# Altium schematic sheet 01_MCU_POWER.SchDoc
size A2; SheetNumber: 2; SheetTotal: 4
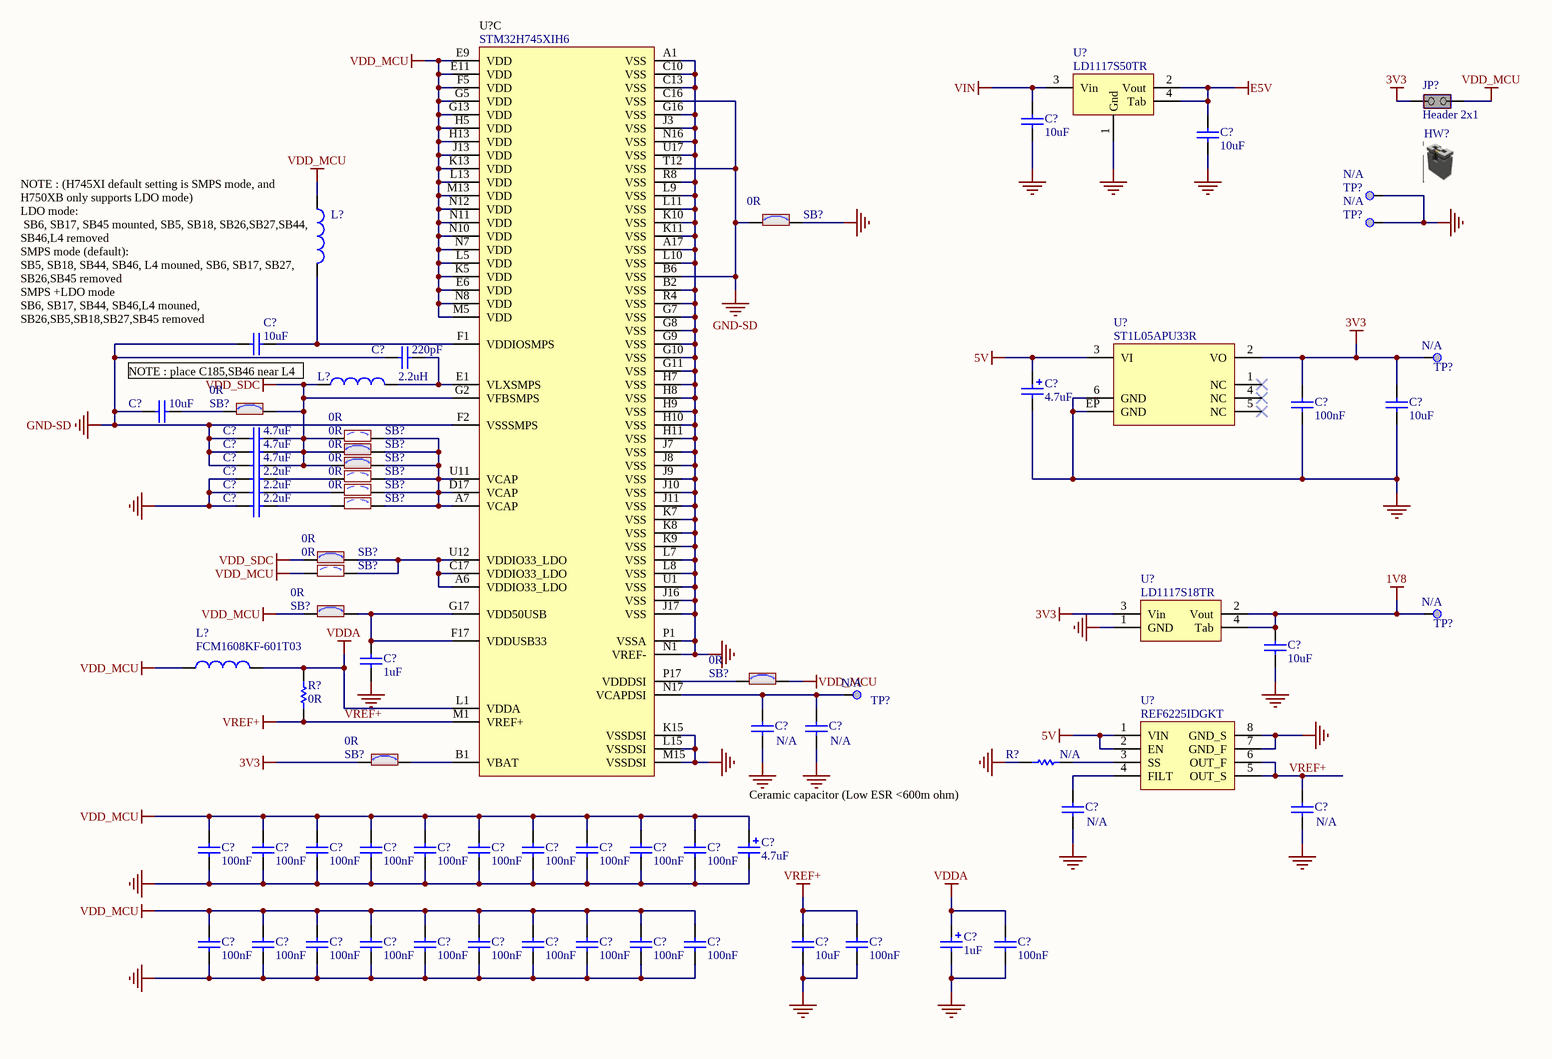
[diagram p0: 01_MCU_POWER.SchDoc]

## Parts
(Parts that share a designator on the sheet are numbered #1, #2 ... from top to bottom, then left to right.)
C?#1  value 10uF  [C0805]  (hidden comment: Capacitor)
C?#2  value 10uF  [C0805]  (hidden comment: Capacitor)
C?#3  value 10uF  [C0402]  (hidden comment: Capacitor)
C?#4  value 220pF  [C0402]  (hidden comment: Capacitor)
C?#5  value 4.7uF  [CPOL_VISHAY_TANTAL-595D_1407_H220]  (hidden comment: Cap_POL_TANA)
C?#6  value 10uF  [C0603]  (hidden comment: Capacitor)
C?#7  value 100nF  [C0402]  (hidden comment: Capacitor)
C?#8  value 10uF  [C0805]  (hidden comment: Capacitor)
C?#9  value 4.7uF  [C0402]  (hidden comment: Capacitor)
C?#10  value 2.2uF  [C0603]  (hidden comment: Capacitor)
C?#11  value 4.7uF  [C0402]  (hidden comment: Capacitor)
C?#12  value 2.2uF  [C0603]  (hidden comment: Capacitor)
C?#13  value 4.7uF  [C0402]  (hidden comment: Capacitor)
C?#14  value 2.2uF  [C0603]  (hidden comment: Capacitor)
C?#15  value 10uF  [C0805]  (hidden comment: Capacitor)
C?#16  value 1uF  [C0603]  (hidden comment: Capacitor)
C?#17  N/A  [C0603]
C?#18  N/A  [C0402]
C?#19  N/A  [C0603]
C?#20  N/A  [C1210]
C?#21  value 4.7uF  [CPOL_VISHAY_TANTAL-595D_1407_H220]  (hidden comment: Cap_POL_TANA)
C?#22  value 100nF  [C0402]  (hidden comment: Capacitor)
C?#23  value 100nF  [C0402]  (hidden comment: Capacitor)
C?#24  value 100nF  [C0402]  (hidden comment: Capacitor)
C?#25  value 100nF  [C0402]  (hidden comment: Capacitor)
C?#26  value 100nF  [C0402]  (hidden comment: Capacitor)
C?#27  value 100nF  [C0402]  (hidden comment: Capacitor)
C?#28  value 100nF  [C0402]  (hidden comment: Capacitor)
C?#29  value 100nF  [C0402]  (hidden comment: Capacitor)
C?#30  value 100nF  [C0402]  (hidden comment: Capacitor)
C?#31  value 100nF  [C0402]  (hidden comment: Capacitor)
C?#32  value 1uF  [CPOL_VISHAY_TANTAL-595D_1407_H220]  (hidden comment: Cap_POL_TANA)
C?#33  value 100nF  [C0402]  (hidden comment: Capacitor)
C?#34  value 100nF  [C0402]  (hidden comment: Capacitor)
C?#35  value 100nF  [C0402]  (hidden comment: Capacitor)
C?#36  value 100nF  [C0402]  (hidden comment: Capacitor)
C?#37  value 100nF  [C0402]  (hidden comment: Capacitor)
C?#38  value 100nF  [C0402]  (hidden comment: Capacitor)
C?#39  value 100nF  [C0402]  (hidden comment: Capacitor)
C?#40  value 100nF  [C0402]  (hidden comment: Capacitor)
C?#41  value 100nF  [C0402]  (hidden comment: Capacitor)
C?#42  value 100nF  [C0402]  (hidden comment: Capacitor)
C?#43  value 10uF  [C0805]  (hidden comment: Capacitor)
C?#44  value 100nF  [C0402]  (hidden comment: Capacitor)
C?#45  value 100nF  [C0402]  (hidden comment: Capacitor)
HW?  Shunt 2.54mm  [N/A]  (value not drawn)  (mechanical)
JP?  value Header 2x1  [CON_SAMTEC_TSW-102-07-G-S]  (hidden comment: Shunt Fitted)
L?#1  Inductor  [IND_TAIYO-YUDEN_FBMJ1608]  (value not drawn)
L?#2  value 2.2uH  [IND_2016_MURATA_LQM2MPN2R2NG0]
L?#3  Manufacturer_Part_Number: FCM1608KF-601T03  [L0603]  (hidden comment: BEAD)
R?#1  value 0R  [R0603]  (hidden comment: Resistor)
R?#2  N/A  [R0402]
SB?#1  value 0R  [SOLDER-BRIDGE_R0603-0R]  (hidden comment: SB_ON)
SB?#2  value 0R  [SOLDER-BRIDGE_R0603-0R]  (hidden comment: SB_ON)
SB?#3  value 0R  [SOLDER-BRIDGE_R0603-0R]  (hidden comment: SB_OFF)
SB?#4  value 0R  [SOLDER-BRIDGE_R0603-0R]  (hidden comment: SB_ON)
SB?#5  value 0R  [SOLDER-BRIDGE_R0603-0R]  (hidden comment: SB_ON)
SB?#6  value 0R  [SOLDER-BRIDGE_R0603-0R]  (hidden comment: SB_OFF)
SB?#7  value 0R  [SOLDER-BRIDGE_R0603-0R]  (hidden comment: SB_OFF)
SB?#8  value 0R  [SOLDER-BRIDGE_R0603-0R]  (hidden comment: SB_OFF)
SB?#9  value 0R  [SOLDER-BRIDGE_R0603-0R]  (hidden comment: SB_ON)
SB?#10  value 0R  [SOLDER-BRIDGE_R0603-0R]  (hidden comment: SB_OFF)
SB?#11  value 0R  [SOLDER-BRIDGE_R0603-0R]  (hidden comment: SB_ON)
SB?#12  value 0R  [SOLDER-BRIDGE_R0603-0R]  (hidden comment: SB_ON)
SB?#13  value 0R  [SOLDER-BRIDGE_R0603-0R]  (hidden comment: SB_ON)
TP?#1  Test Point  [TP_SMD_0-3MM]  (value not drawn)  (no BOM)
TP?#2  Test Point  [TP_SMD_0-3MM]  (value not drawn)  (no BOM)
TP?#3  Test Point  [TP_SMD_0-3MM]  (value not drawn)  (no BOM)
TP?#4  Test Point  [TP_SMD_0-3MM]  (value not drawn)  (no BOM)
TP?#5  Test Point  [TP_SMD_0-3MM]  (value not drawn)  (no BOM)
U?#1  value STM32H745XIH6  [ICC_TFBGA240+25_14X14_STM32H745H6U_P080]  (part C of 3)
U?#2  LD1117S50TR  [REG_SOT223-TAB]
U?#3  ST1L05APU33R  [ICC_DFN6-EPAD_3X3_P095]
U?#4  value LD1117S18TR  [REG_SOT223-TAB]
U?#5  value REF6225IDGKT  [ICC_VSSOP8_DGK_S-PDSO-G8_3X3_P065]

## Nets
1V8: C?#15.2 TP?#4.1 U?#4.2(Vout) U?#4.4(Tab)
3V3: C?#7.1 C?#8.2 JP?.2(NO) SB?#13.1 TP?#3.1 U?#3.2(VO) U?#4.3(Vin)
5V: C?#5.1 U?#3.3(VI) U?#5.1(VIN) U?#5.2(EN)
E5V: C?#2.2 U?#2.2(Vout) U?#2.4(Tab)
GND: C?#1.1 C?#2.1 C?#5.2 C?#7.2 C?#8.1 C?#10.1 C?#12.1 C?#14.1 C?#15.1 C?#16.1 C?#17.1 C?#18.1 C?#19.1 C?#20.1 C?#21.2 C?#22.1 C?#23.1 C?#24.1 C?#25.1 C?#26.1 C?#27.1 C?#28.1 C?#29.1 C?#30.1 C?#31.1 C?#32.2 C?#33.1 C?#34.1 C?#35.1 C?#36.1 C?#37.1 C?#38.1 C?#39.1 C?#40.1 C?#41.1 C?#42.1 C?#43.1 C?#44.1 C?#45.1 R?#2.1 SB?#1.2 TP?#1.1 TP?#2.1 U?#1.A1(VSS) U?#1.A17(VSS) U?#1.B2(VSS) U?#1.C10(VSS) U?#1.C13(VSS) U?#1.G7(VSS) U?#1.G8(VSS) U?#1.G9(VSS) U?#1.G10(VSS) U?#1.G11(VSS) U?#1.G16(VSS) U?#1.H7(VSS) U?#1.H8(VSS) U?#1.H9(VSS) U?#1.H10(VSS) U?#1.H11(VSS) U?#1.J3(VSS) U?#1.J7(VSS) U?#1.J8(VSS) U?#1.J9(VSS) U?#1.J10(VSS) U?#1.J11(VSS) U?#1.J16(VSS) U?#1.J17(VSS) U?#1.K7(VSS) U?#1.K8(VSS) U?#1.K9(VSS) U?#1.K10(VSS) U?#1.K11(VSS) U?#1.K15(VSSDSI) U?#1.L7(VSS) U?#1.L8(VSS) U?#1.L9(VSS) U?#1.L10(VSS) U?#1.L11(VSS) U?#1.L15(VSSDSI) U?#1.M15(VSSDSI) U?#1.N1(VREF-) U?#1.N16(VSS) U?#1.P1(VSSA) U?#1.R4(VSS) U?#1.R8(VSS) U?#1.U1(VSS) U?#1.U17(VSS) U?#2.1(Gnd) U?#3.6(GND) U?#3.EP(GND) U?#4.1(GND) U?#5.7(GND_F) U?#5.8(GND_S)
GND-SD: C?#3.1 C?#4.1 C?#6.1 C?#9.2 C?#11.2 C?#13.2 SB?#1.1 U?#1.B6(VSS) U?#1.C16(VSS) U?#1.F2(VSSSMPS) U?#1.T12(VSS)
VDD_MCU: C?#21.1 C?#22.2 C?#23.2 C?#24.2 C?#25.2 C?#26.2 C?#27.2 C?#28.2 C?#29.2 C?#30.2 C?#31.2 C?#33.2 C?#34.2 C?#35.2 C?#36.2 C?#37.2 C?#38.2 C?#39.2 C?#40.2 C?#41.2 C?#42.2 JP?.1(COMMON) L?#1.1 L?#3.1 SB?#10.1 SB?#11.1 SB?#12.2 U?#1.E6(VDD) U?#1.E9(VDD) U?#1.E11(VDD) U?#1.F5(VDD) U?#1.G5(VDD) U?#1.G13(VDD) U?#1.H5(VDD) U?#1.H13(VDD) U?#1.J13(VDD) U?#1.K5(VDD) U?#1.K13(VDD) U?#1.L5(VDD) U?#1.L13(VDD) U?#1.M5(VDD) U?#1.M13(VDD) U?#1.N7(VDD) U?#1.N8(VDD) U?#1.N10(VDD) U?#1.N11(VDD) U?#1.N12(VDD)
VDD_SDC: C?#9.1 C?#11.1 C?#13.1 L?#2.1 SB?#2.2 SB?#3.1 SB?#4.1 SB?#5.1 SB?#9.1 U?#1.G2(VFBSMPS)
VDDA: C?#32.1 C?#45.2 L?#3.2 R?#1.1 U?#1.L1(VDDA)
VIN: C?#1.2 U?#2.3(Vin)
VREF+: C?#20.2 C?#43.2 C?#44.2 R?#1.2 U?#1.M1(VREF+) U?#5.5(OUT_S) U?#5.6(OUT_F)
NetC?#3_2: C?#3.2 L?#1.2 U?#1.F1(VDDIOSMPS)
NetC?#4_2: C?#4.2 L?#2.2 U?#1.E1(VLXSMPS)
NetC?#6_2: C?#6.2 SB?#2.1
NetC?#10_2: C?#10.2 SB?#6.1
NetC?#12_2: C?#12.2 SB?#7.1
NetC?#14_2: C?#14.2 SB?#8.1
NetC?#16_2: C?#16.2 SB?#11.2 U?#1.F17(VDDUSB33) U?#1.G17(VDD50USB)
NetC?#17_2: C?#17.2 C?#18.2 TP?#5.1 U?#1.N17(VCAPDSI)
NetC?#19_2: C?#19.2 U?#5.4(FILT)
NetR?#2_2: R?#2.2 U?#5.3(SS)
NetSB?#3_2: SB?#3.2 SB?#4.2 SB?#5.2 SB?#6.2 SB?#7.2 SB?#8.2 U?#1.A7(VCAP) U?#1.D17(VCAP) U?#1.U11(VCAP)
NetSB?#9_2: SB?#9.2 SB?#10.2 U?#1.A6(VDDIO33_LDO) U?#1.C17(VDDIO33_LDO) U?#1.U12(VDDIO33_LDO)
NetSB?#12_1: SB?#12.1 U?#1.P17(VDDDSI)
NetSB?#13_2: SB?#13.2 U?#1.B1(VBAT)

Not connected (* = marked no-connect by the designer): U?#3 1(NC)* 4(NC)* 5(NC)*

## Notes on the sheet
- (near L?#1) NOTE : (H745XI default setting is SMPS mode, and H750XB only supports LDO mode)
  LDO mode:
  SB6, SB17, SB45 mounted, SB5, SB18, SB26,SB27,SB44, SB46,L4 removed
  SMPS mode (default):
  SB5, SB18, SB44, SB46, L4 mouned, SB6, SB17, SB27, SB26,SB45 removed
  SMPS +LDO mode
  SB6, SB17, SB44, SB46,L4 mouned, SB26,SB5,SB18,SB27,SB45 removed
- NOTE : place C185,SB46 near L4
- (near C?#21) Ceramic capacitor (Low ESR <600m ohm)

## Library data of the parts
C?#1 C?#2 C?#8 C?#15 C?#43 = MCD-00014: Capacitor, MLCC, 10uF, 25V, X5R, 10%, 0805, T=0,85mm; Manufacturer_Part_Number: CC0805KRX5R8BB106; Manufacturer: YAGEO; Full_Alternate_Internal_Part_Number: MCD-02385; Part_Preference: Recommended; Partial_Alternate_Internal_Part_Number: MCD-03053; Provided_By: Subcon; Initial_Board_Reference: mb1274; Component_Country_Of_Origin: China; ID: 2468; ShowFields: YES; Internal_Part_Number: MCD-00014; ECCN_US: n/a; ECCN_EU: n/a; ComponentLink1Description: Yageo_Capacitor_X5R-series.pdf; Status: Released; Part_Type: Capacitor; Package: 0805; ComponentLink1URL: http://tunmcdsvn.tun.st.com/Component_Documentation_Library/Trunk/Capacitor/YAGEO_X5R_Series; Order_Code_Digikey: 311-3503-1-ND; Order_Code_Farnell: N/A; Order_Code_RS: N/A
C?#3 = MCD-01355: Capacitor, MLCC, 10uF, 4V, X5R, 20%, 0402, T=0,5mm; Manufacturer_Part_Number: GRM155R60G106ME44; Manufacturer: MURATA; Part_Preference: Recommended; Partial_Alternate_Internal_Part_Number: MCD-01716, MCD-02999; Provided_By: Subcon; Initial_Board_Reference: MB1372; Component_Country_Of_Origin: Japan°°; ID: 3455; Order_Code_RS: 172-6477; ShowFields: YES; Internal_Part_Number: MCD-01355; ComponentLink1Description: Datasheet; Status: Released; Part_Type: Capacitor; Package: 0402; ComponentLink1URL: http://tunmcdsvn.tun.st.com/Component_Documentation_Library/Trunk/Capacitor/MURATA_GRM_Series; Order_Code_Digikey: 490-10693-1-ND; Order_Code_Farnell: 2611904
C?#4 = MCD-01225: Capacitor, MLCC, 220pF, 50V, NPO, 5%, 0402, T=0,5mm; Manufacturer_Part_Number: CC0402JRNPO9BN221; Manufacturer: YAGEO; Part_Preference: Recommended; Provided_By: Subcon; Initial_Board_Reference: MB1331; Component_Country_Of_Origin: China; ID: 3272; Order_Code_RS: 616-9284; ShowFields: YES; Internal_Part_Number: MCD-01225; Status: Released; Part_Type: Capacitor; Package: 0402; ComponentLink1Description: Datasheet; ComponentLink1URL: http://tunmcdsvn.tun.st.com/Component_Documentation_Library/Trunk/Capacitor/YAGEO_NP0_Series; Order_Code_Digikey: 311-1416-1-ND; Order_Code_Farnell: 3019240
C?#5 C?#21 = MCD-00595: Capacitor, Tantalum, 4.7uF, 16V, +/-10%, 595D case A; Manufacturer_Part_Number: 595D475X9016A2T; Manufacturer: VISHAY; Part_Preference: Recommended; Order_Code_RS: 117-303; Provided_By: Subcon; Initial_Board_Reference: MB1331; Component_Country_Of_Origin: Israel; ID: 3146; ShowFields: YES; Revision: July-2002: Re-released for DXP Platform.; Internal_Part_Number: MCD-00595; Status: Released; Part_Type: Capacitor; ComponentLink1Description: VISHAY_CAPACITOR_TANTALUM_595D.pdf; ComponentLink1URL: http://tunmcdsvn.tun.st.com/Component_Documentation_Library/Trunk/Capacitor/VISHAY_595D_Series; Order_Code_Digikey: 595D475X9016A2T-ND; Order_Code_Farnell: 1166805; Package: 3718 (metric)
C?#6 = MCD-01341: Capacitor, MLCC, 10uF, 6V3, X5R, 20%, 0603, T=0,8mm; Manufacturer_Part_Number: GRM188R60J106ME47D; Manufacturer: MURATA; Part_Preference: Recommended; Provided_By: Subcon; Initial_Board_Reference: MB1331; Component_Country_Of_Origin: Japan°°; ID: 3441; ShowFields: YES; Internal_Part_Number: MCD-01341; ComponentLink1Description: Datasheet; Status: Released; Part_Type: Capacitor; Package: 0603; ComponentLink1URL: http://tunmcdsvn.tun.st.com/Component_Documentation_Library/Trunk/Capacitor/MURATA_GRM_Series; Order_Code_Digikey: 490-3896-1-ND; Order_Code_Farnell: 1735528; Order_Code_RS: N/A
C?#7 C?#18 C?#22-C?#31 C?#33-C?#42 C?#44 C?#45 = MCD-00006: Capacitor, MLCC, 100nF, 16V, X7R, +/-10%, 0402, T=0.5mm; Manufacturer_Part_Number: CC0402KRX7R7BB104; Manufacturer: YAGEO; Part_Preference: Recommended; Partial_Alternate_Internal_Part_Number: MCD-03299; Component_Country_Of_Origin: China; ID: 2474; Order_Code_RS: 9402047; ShowFields: YES; Internal_Part_Number: MCD-00006; Status: Released; Part_Type: Capacitor; Package: 0402; ComponentLink1URL: http://tunmcdsvn.tun.st.com/Component_Documentation_Library/Trunk/Capacitor/YAGEO_X7R_Series; Order_Code_Digikey: 311-1338-1-ND; Order_Code_Farnell: 9402047
  C?#18: Value: 100nF
C?#9 C?#11 C?#13 = MCD-01356: Capacitor, MLCC, 4.7uF, 6V3, X5R, 20%, 0402, T=0,5mm; Manufacturer_Part_Number: GRM155R60J475ME47; Manufacturer: MURATA; Part_Preference: Recommended; Provided_By: Subcon; Initial_Board_Reference: MB1372; Component_Country_Of_Origin: Japan°°; ID: 3456; Order_Code_RS: 814-5230; ShowFields: YES; Internal_Part_Number: MCD-01356; ComponentLink1Description: Datasheet; Status: Released; Part_Type: Capacitor; Package: 0402; ComponentLink1URL: http://tunmcdsvn.tun.st.com/Component_Documentation_Library/Trunk/Capacitor/MURATA_GRM_Series; Order_Code_Digikey: 490-5915-1-ND; Order_Code_Farnell: 2666407
C?#10 C?#12 C?#14 C?#17 = MCD-00012: Capacitor, MLCC, 2.2uF, 10V, X5R, 10%, 0603, T=0,8mm; Manufacturer_Part_Number: CC0603KRX5R6BB225; Manufacturer: YAGEO; Alternate_Manufacturer_Part_Number: C0603C225K8PACTU; Alternate_Manufacturer: KEMET; BMS_Part_Number: 9142010; Part_Preference: Recommended; Partial_Alternate_Internal_Part_Number: MCD-00551; Provided_By: Subcon; Initial_Board_Reference: MB1274; Component_Country_Of_Origin: China; ID: 2467; Order_Code_RS: 2370679; ShowFields: YES; Internal_Part_Number: MCD-00012; Status: Released; Part_Type: Capacitor; Package: 0603; ComponentLink1Description: Yageo_Capacitor_X5R-series.pdf; ComponentLink1URL: http://tunmcdsvn.tun.st.com/Component_Documentation_Library/Trunk/Capacitor/YAGEO_X5R_Series; ECCN_US: n/a; ECCN_EU: n/a; Order_Code_Digikey: 311-1451-1-ND; Order_Code_Farnell: 2370679
  C?#17: Value: 2.2uF
C?#16 C?#19 = MCD-00010: Capacitor, MLCC, 1uF, 16V, X5R, 10%, 0603, T=0,8mm; Manufacturer_Part_Number: CC0603KRX5R7BB105; Manufacturer: YAGEO; Part_Preference: Recommended; Provided_By: Subcon; Initial_Board_Reference: mb1274; Component_Country_Of_Origin: China; ID: 2470; Order_Code_RS: 2370680; ShowFields: YES; Internal_Part_Number: MCD-00010; Status: Released; Part_Type: Capacitor; Package: 0603; ComponentLink1Description: Yageo_Capacitor_X5R-series.pdf; ComponentLink1URL: http://tunmcdsvn.tun.st.com/Component_Documentation_Library/Trunk/Capacitor/YAGEO_X5R_Series; ECCN_US: n/a; ECCN_EU: n/a; Order_Code_Digikey: 311-1444-1-ND; Order_Code_Farnell: 2370680
  C?#19: Value: 1uF
C?#20 = MCD-00614: Capacitor, MLCC, 22uF, 16V, 1210, X7R, 20%, T=2,5mm, ESR 2mohm@410KHz; Manufacturer_Part_Number: GCM32ER71C226ME19; Manufacturer: MURATA; Part_Preference: Recommended; Provided_By: Subcon; Initial_Board_Reference: MB1331; Component_Country_Of_Origin: Japan°°; ID: 3130; ShowFields: YES; Internal_Part_Number: MCD-00614; Value: 22uF; Status: Released; Part_Type: Capacitor; Package: 1210; ComponentLink1Description: Murata_22uF_1210_GCM32ER71C226ME19.pdf; ComponentLink1URL: http://tunmcdsvn.tun.st.com/Component_Documentation_Library/Trunk/Capacitor/MURATA_GC_Series; Order_Code_Digikey: 490-14539-1-ND; Order_Code_Farnell: N/A; Order_Code_RS: N/A
C?#32 = MCD-00594: Capacitor, Tantalum, 1uF, 35V, +/-10%, 595D case A; Manufacturer_Part_Number: 595D105X9035A2T; Manufacturer: VISHAY; Part_Preference: Recommended; Order_Code_RS: 117-404; Provided_By: Subcon; Initial_Board_Reference: MB1331; Component_Country_Of_Origin: Israel; ID: 3150; ShowFields: YES; Revision: July-2002: Re-released for DXP Platform.; Internal_Part_Number: MCD-00594; Status: Released; Part_Type: Capacitor; ComponentLink1Description: VISHAY_CAPACITOR_TANTALUM_595D.pdf; ComponentLink1URL: http://tunmcdsvn.tun.st.com/Component_Documentation_Library/Trunk/Capacitor/VISHAY_595D_Series; Order_Code_Digikey: 595D105X9035A2T-ND; Order_Code_Farnell: 1166819; Package: 3718 (metric)
HW? = MCD-00043: SHUNT 2.54mm BLACK; Manufacturer_Part_Number: SNT-100-BK-G; Manufacturer: SAMTEC; Full_Alternate_Internal_Part_Number: MCD-02388; Manufacturer_HQ_COO: Unknown; Part_Preference: Recommended; Part_Type: Misc; Partial_Alternate_Internal_Part_Number: MCD-01849, MCD-01864; Provided_By: Subcon; Alternate_EMS: A; Component_Country_Of_Origin: China, Costa Rica, Malaysia, USA, Vietnam; ID: 2551; Order_Code_RS: 158-7784; ShowFields: YES; Value: SNT-100-BK-G; Internal_Part_Number: MCD-00043; PartType: Mechanical; ECCN_US: n/a; ECCN_EU: n/a; ComponentLink1Description: Samtec_Shunt_Jumper_SNT100.pdf; ComponentLink1URL: http://tunmcdsvn.tun.st.com/Component_Documentation_Library/Trunk/Misc/SAMTEC_SNT-100-BK-G; Order_Code_Digikey: SAM8858-ND; Order_Code_Farnell: 2505007; Package: 2.54x5.08mm; Status: Released
JP? = MCD-00683: Header, 2x1, 2.54mm, VR, TH, T=5.84mm/2.54mm; Part_Type: Connector; Manufacturer_Part_Number: TSW-102-07-G-S; Manufacturer: SAMTEC; Part_Preference: Recommended; Full_Alternate_Internal_Part_Number: MCD-02389; Partial_Alternate_Internal_Part_Number: MCD-02957, MCD-03720; Component_Country_Of_Origin: China, Costa Rica, Malaysia, USA, Vietnam; ID: 3057; Order_Code_RS: 155-5312; ShowFields: YES; Internal_Part_Number: MCD-00683; Status: Released; ComponentLink1URL: http://tunmcdsvn.tun.st.com/Component_Documentation_Library/Trunk/Connector/SAMTEC_TSW_Series/; Order_Code_Digikey: SAM1029-02-ND; Order_Code_Farnell: 2505044
L?#1 = MCD-01431: Ferrite bead, 18R @ 100MHz, +/-30%, 750mA, 0R004, 0603, T=1mm; Manufacturer_Part_Number: FBMJ1608HM180NTR; Manufacturer: TAIYO YUDEN; Part_Preference: Forbidden; ShowFields: YES; ID: 3531; Component_Country_Of_Origin: Unknown; Internal_Part_Number: MCD-01431; Value: 18R @ 100MHz; Status: Obsolete; Part_Type: Inductor; Package: 0603; ComponentLink1URL: http://tunmcdsvn.tun.st.com/Component_Documentation_Library/Trunk/Inductor/TAIYO_YUDEN_FB-M_Series; Order_Code_Digikey: 587-3251-1-ND; Order_Code_Farnell: 2860452; Order_Code_RS: N/A
L?#2 = MCD-01110: Inductor 2.2uH, 2x1.6x0.9mm; Manufacturer_Part_Number: LQM2MPN2R2NG0; Manufacturer: MURATA; Part_Preference: Recommended; Provided_By: Subcon; Initial_Board_Reference: MB1381; Component_Country_Of_Origin: Japan°°; ID: 3384; ShowFields: YES; Internal_Part_Number: MCD-01110; Status: Checked; Part_Type: Inductor; ComponentLink1Description: Murata_inductor_LQM2MPN.pdf; ComponentLink1URL: http://tunmcdsvn.tun.st.com/Component_Documentation_Library/Trunk/Inductor/MURATA_LQM_Series; ECCN_US: n/a; ECCN_EU: n/a; Order_Code_Digikey: 490-7786-1-ND; Order_Code_Farnell: 2470314; Order_Code_RS: N/A; Package: 0806
L?#3 = MCD-00047: Ferrite bead, 600R @1 00MHz, +/-25%, 350mA, 0R5, 0603, T=0.8mm; Part_Type: Inductor; Manufacturer: TAI-TECH; Part_Preference: Recommended; Partial_Alternate_Internal_Part_Number: MCD-02959; Component_Country_Of_Origin: Unknown; ID: 2546; ShowFields: YES; Internal_Part_Number: MCD-00047; Value: 600R @ 100MHz; Status: Released; ComponentLink1URL: http://tunmcdsvn.tun.st.com/Component_Documentation_Library/Trunk/Inductor/TAI-TECH_FCM-1608_Series; Order_Code_Digikey: N/A; Order_Code_Farnell: N/A; Order_Code_RS: N/A; Package: 0603
R?#1 = MCD-00181: Resistor,0R,0603,ULO; Manufacturer_Part_Number: PMR03EZPJ000; Manufacturer: ROHM SEMICONDUCTOR; Part_Preference: Recommended; Provided_By: Subcon; Component_Country_Of_Origin: Philippines, Thailand°°; ID: 2691; ShowFields: YES; Internal_Part_Number: MCD-00181; Status: Released; Part_Type: Resistor; Package: 0603; ComponentLink1Description: ROHM_ULtra low Ohmic Resistor _PMR10EZPJ000.pdf; ComponentLink1URL: http://tunmcdsvn.tun.st.com/Component_Documentation_Library/Trunk/Resistor/ROHM_PMR_Series; ECCN_US: n/a; ECCN_EU: n/a; Order_Code_Digikey: PMR03EZPJ000-ND; Order_Code_Farnell: N/A; Order_Code_RS: N/A
R?#2 = MCD-00166: Resistor,120K,0402,1%,1/16W; Manufacturer_Part_Number: RC0402FR-07120KL; Manufacturer: YAGEO; Part_Preference: Recommended; Provided_By: Subcon; Initial_Board_Reference: MB1264; Component_Country_Of_Origin: China; ID: 2703; ShowFields: YES; Internal_Part_Number: MCD-00166; Value: 120K; Status: Checked; Part_Type: Resistor; Package: 0402; ComponentLink1Description: Yageo_Resistor_RC0402-series.pdf; ComponentLink1URL: http://tunmcdsvn.tun.st.com/Component_Documentation_Library/Trunk/Resistor/YAGEO_RC_L_Series; ECCN_US: n/a; ECCN_EU: n/a; Order_Code_Digikey: 311-120KLRCT-ND; Order_Code_Farnell: 9239480; Order_Code_RS: N/A
SB?#1 SB?#2 SB?#4 SB?#5 SB?#9 SB?#11-SB?#13 = MCD-00071: Solder Bridge ON; Part_Type: Resistor; Manufacturer: YAGEO; Manufacturer_HQ_COO: Unknown; Manufacturer_Part_Number: RC0603JR-070RL; Part_Preference: Recommended; Provided_By: Subcon; Initial_Board_Reference: mb1274; Component_Country_Of_Origin: China; ID: 2521; Order_Code_RS: 199-5647; ShowFields: YES; Internal_Part_Number: MCD-00071; ECCN_US: n/a; ECCN_EU: n/a; Status: Released; ComponentLink1URL: http://tunmcdsvn.tun.st.com/Component_Documentation_Library/Trunk/Resistor/YAGEO_RC_Series; Order_Code_Digikey: 311-0.0GRTR-ND; Order_Code_Farnell: 2421846; Package: 0603
SB?#3 SB?#6-SB?#8 SB?#10 = MCD-00072: Solder Bridge OFF; Part_Type: Resistor; Manufacturer: YAGEO; Manufacturer_HQ_COO: Unknown; Manufacturer_Part_Number: RC0603JR-070RL; Part_Preference: Recommended; Initial_Board_Reference: mb1274; Component_Country_Of_Origin: China; ID: 2520; Order_Code_RS: 199-5647; ShowFields: YES; Internal_Part_Number: MCD-00072; Status: Released; ECCN_US: n/a; ECCN_EU: n/a; Provided_By: n/a; ComponentLink1URL: http://tunmcdsvn.tun.st.com/Component_Documentation_Library/Trunk/Resistor/YAGEO_RC_Series; Order_Code_Digikey: 311-0.0GRTR-ND; Order_Code_Farnell: 2421846; Package: 0603
TP?#1-TP?#5 = MCD-00630: Test Point 0.3mm; Part_Type: Misc; Part_Preference: Recommended; Initial_Board_Reference: MB1264; ID: 3115; ShowFields: YES; Component_Country_Of_Origin: Unknown; Internal_Part_Number: MCD-00630; Status: Released; ECCN_US: n/a; ECCN_EU: n/a; Provided_By: n/a; Manufacturer: N/A; Manufacturer_Part_Number: N/A; Order_Code_Digikey: N/A; Order_Code_Farnell: N/A; Order_Code_RS: N/A; Value: N/A; ComponentLink1URL: http://tunmcdsvn.tun.st.com/Component_Documentation_Library/Trunk; Manufacturer_HQ_COO: Unknown
U?#1 = MCD-01085: 32bit MCU TFBGA240+25; Part_Type: IC; Manufacturer: STMICROELECTRONICS; BMS_Part_Number: 9175307; Manufacturer_HQ_COO: EU; Part_Preference: Recommended; Provided_By: STM; Initial_Board_Reference: MB1381; Component_Country_Of_Origin: Philippines; ID: 3408; ShowFields: YES; Internal_Part_Number: MCD-01085; Status: Checked; Manufacturer_Part_Number: STM32H745XIH6; Package: TFBGA-265; ComponentLink1Description: Datasheet; ComponentLink1URL: http://tunmcdsvn.tun.st.com/Component_Documentation_Library/Trunk/IC/STMICROELECTRONICS_STM32H745x; Order_Code_Digikey: 497-19502-ND; Order_Code_Farnell: 3365366; Order_Code_RS: N/A
U?#2 = MCD-00088: IC REG LDO 5V 0.8A SOT223; Manufacturer: STMICROELECTRONICS; BMS_Part_Number: 9176133; Manufacturer_HQ_COO: EU; Part_Preference: Recommended; ECCN_US: EAR99; ECCN_EU: NEC; Provided_By: Subcon; Initial_Board_Reference: mb1274; Component_Country_Of_Origin: China; ID: 2503; Order_Code_RS: 165-7748; ShowFields: YES; Internal_Part_Number: MCD-00088; Value: LD1117S50TR; Status: Released; Part_Type: IC; Manufacturer_Part_Number: LD1117S50TR; ComponentLink1Description: STM_LDO_LD1117.pdf; ComponentLink1URL: http://tunmcdsvn.tun.st.com/Component_Documentation_Library/Trunk/IC/STMICROELECTRONICS_LD1117S50TR; Order_Code_Digikey: 497-6447-2-ND; Order_Code_Farnell: 1467781; Package: SOT223-4
U?#3 = MCD-01127: IC REG LDO 3.3V 1.3A 6DFN; Manufacturer: STMICROELECTRONICS; BMS_Part_Number: 9176247; Manufacturer_HQ_COO: EU; Part_Preference: Recommended; ECCN_US: EAR99; ECCN_EU: NEC; Provided_By: Subcon; Initial_Board_Reference: MB1381; Component_Country_Of_Origin: Malaysia; ID: 3368; ShowFields: YES; Internal_Part_Number: MCD-01127; Value: ST1L05APU33R; Status: Released; Part_Type: IC; Manufacturer_Part_Number: ST1L05APU33R; Package: DFN-6; ComponentLink1Description: STM_LDO_ST1L05CPU33R.pdf; ComponentLink1URL: http://tunmcdsvn.tun.st.com/Component_Documentation_Library/Trunk/IC/STMICROELECTRONICS_ST1L05APU33R; Order_Code_Digikey: 497-8980-2-ND; Order_Code_Farnell: N/A; Order_Code_RS: N/A
U?#4 = MCD-01070: Adjustable and fixed low drop positive voltage regulator; Part_Type: IC; Manufacturer: STMICROELECTRONICS; BMS_Part_Number: 9176180; Manufacturer_HQ_COO: EU; Part_Preference: Recommended; ECCN_US: EAR99; ECCN_EU: NEC; Provided_By: Subcon; Initial_Board_Reference: MB1381; Component_Country_Of_Origin: China; ID: 3422; Order_Code_RS: 686-9375; ShowFields: YES; Internal_Part_Number: MCD-01070; Status: Checked; Manufacturer_Part_Number: LD1117S18TR; Package: SOT-223; ComponentLink1Description: STM_LDO_LD1117S18TR.pdf; ComponentLink1URL: http://tunmcdsvn.tun.st.com/Component_Documentation_Library/Trunk/IC/STMICROELECTRONICS_LD1117S18TR; Order_Code_Digikey: 497-7308-2-ND; Order_Code_Farnell: 3367145
U?#5 = MCD-01138: IC VREF SERIES 2.5V 8VSSOP; Manufacturer: TEXAS INSTRUMENTS; Part_Preference: Recommended; Provided_By: Subcon; Initial_Board_Reference: MB1381; Component_Country_Of_Origin: Thailand; ID: 3357; ShowFields: YES; Internal_Part_Number: MCD-01138; Status: Checked; Part_Type: IC; Manufacturer_Part_Number: REF6225IDGKT; Package: VSSOP-8; ComponentLink1Description: TI_REF_REF6225IDGKT; ComponentLink1URL: http://tunmcdsvn.tun.st.com/Component_Documentation_Library/Trunk/IC/TEXAS_INSTRUMENTS_REF6225IDGKT; ECCN_US: N/A; ECCN_EU: N/A; Order_Code_Digikey: 296-44922-2-ND; Order_Code_Farnell: N/A; Order_Code_RS: N/A